# EAGLE design usb_tester_OLED (EAGLE 6.3)
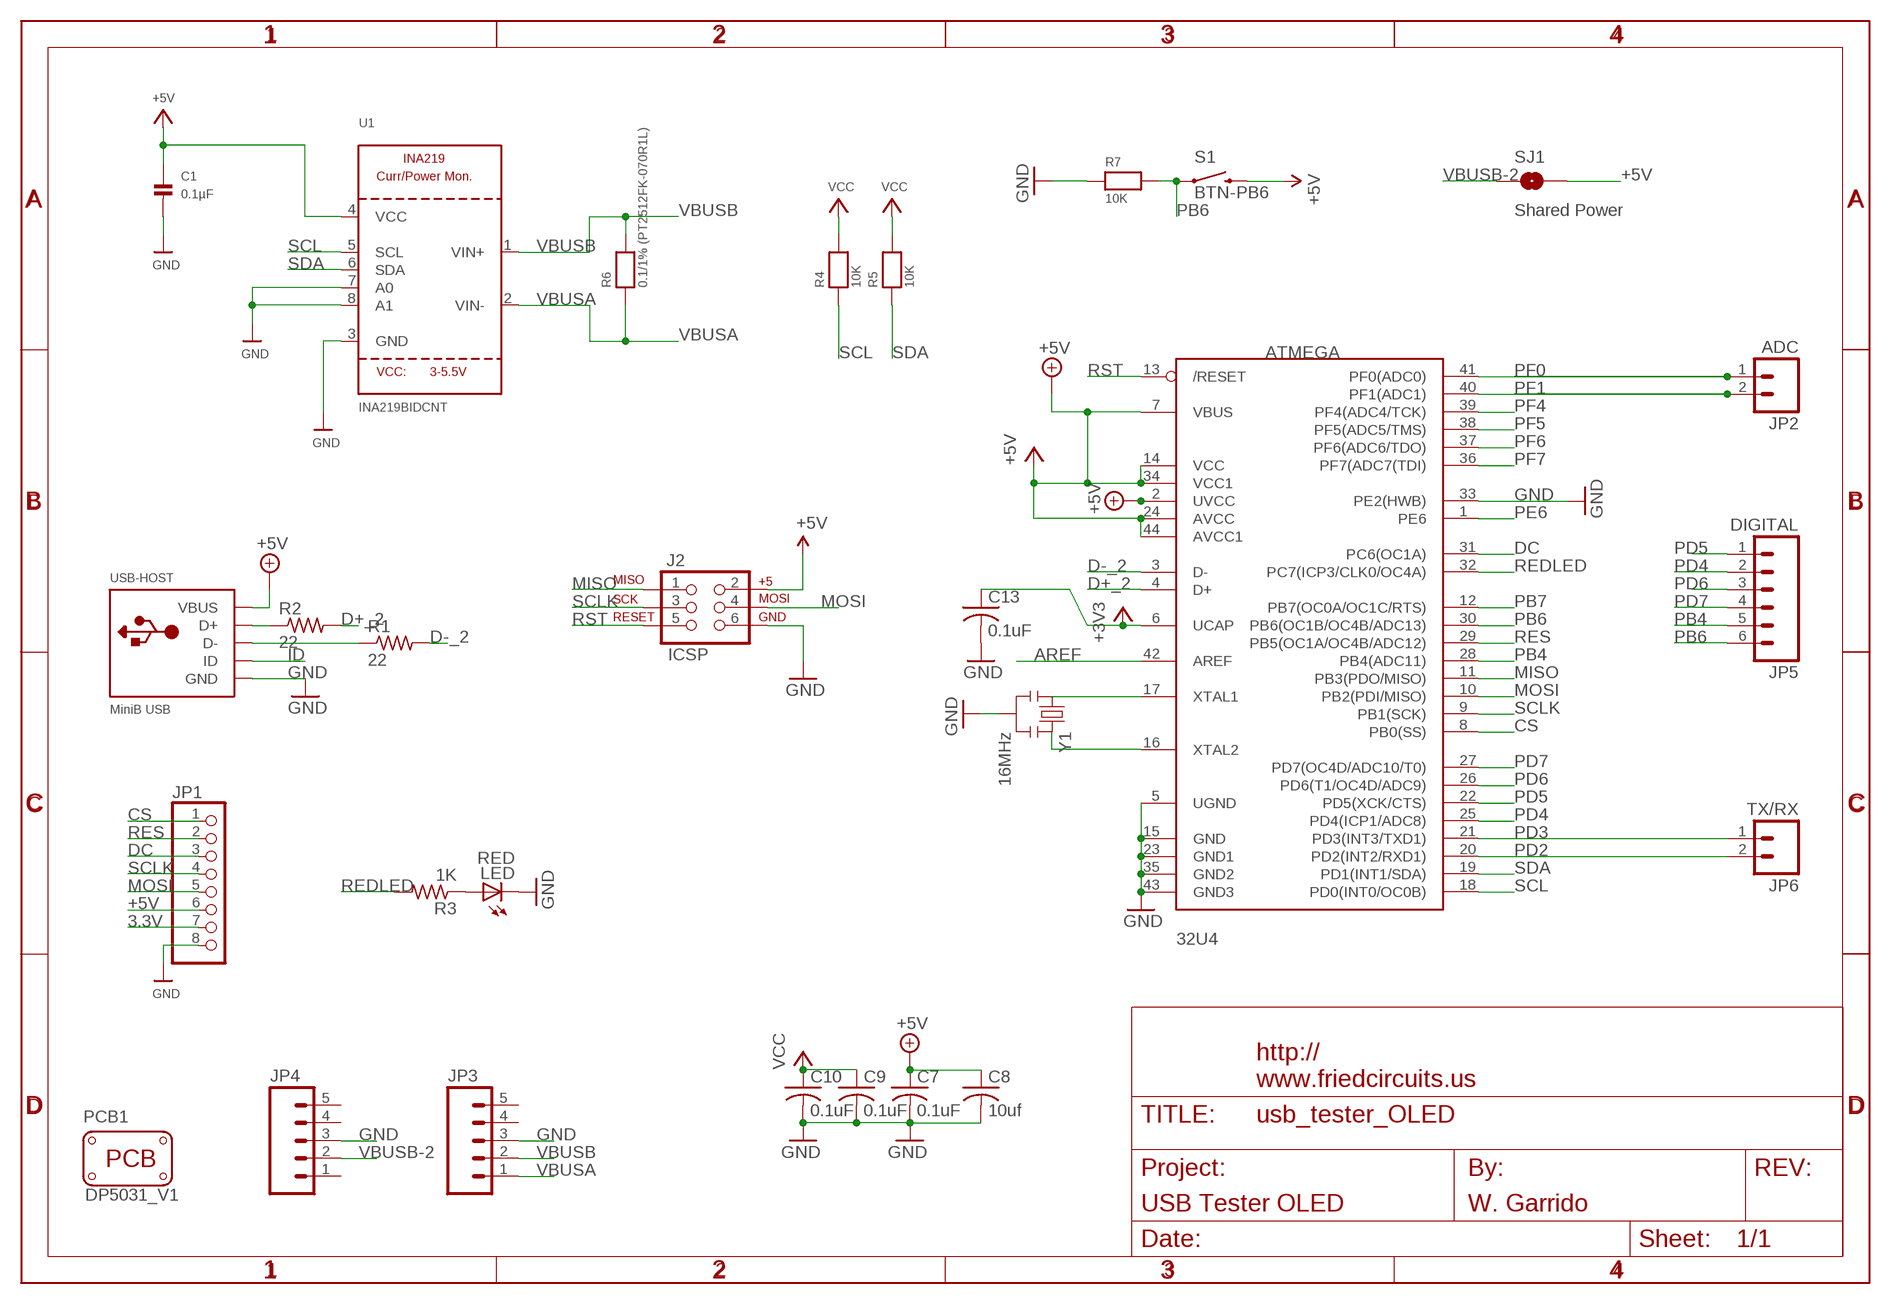
[diagram p0: schematic, sheet 1]

## Parts
32U4  ATMEGA  ATMEGA32U4-AU  [TQFP44]
C1  0.1µF  CAP_CERAMIC0805  [0805]
C7  0.1uF  C-USC0805K  [C0805K]
C8  10uf  C-USC0805K  [C0805K]
C9  0.1uF  C-USC0805K  [C0805K]
C10  0.1uF  C-USC0805K  [C0805K]
C13  0.1uF  C-USC0805K  [C0805K]
J2  ICSP  AVR_SPI_PRG_62X3_LOCK  [2X3_LOCK]
JP1  HEADER-1X876MIL  [1X08_ROUND_76]
JP2  ADC  M02LOCK  [1X02_LOCK]
JP3  M05LOCK  [1X05_LOCK]
JP4  M05LOCK  [1X05_LOCK]
JP5  DIGITAL  M06LOCK  [1X06_LOCK]
JP6  TX/RX  M02LOCK  [1X02_LOCK]
LED  RED  LEDCHIPLED_0805  [CHIPLED_0805]
PCB1  PCB_DP_RECTANGLE-31X50  [DP5031_V1]
R1  22  R-US_R0805  [R0805]
R2  22  R-US_R0805  [R0805]
R3  1K  R-US_R0805  [R0805]
R4  10K  RESISTOR0805  [0805]
R5  10K  RESISTOR0805  [0805]
R6  0.1/1% (PT2512FK-070R1L)  RESISTOR2512  [2512]
R7  10K  RESISTOR0805  [0805]
S1  BTN-PB6  SWITCH-MOMENTARY-2SMD  [TACTILE_SWITCH_SMD]
SJ1  Shared Power  SOLDERJUMPERTRACE  [SJ_2S-TRACE]
U1  INA219BIDCNT  INA219  [SOT23-8]
U$1  FRAME_DINA4_L  [FC_CREDIT]
USB-HOST  MiniB USB  USBMINIB  [USB-MINIB]
Y1  16MHz  RESONATOR16MHZ  [RESONATOR-SMD]

## Nets
3.3V: JP1.7
+3V3 [+3V3]: 32U4.6(UCAP) C13.1
+5V [+5V]: 32U4.2(UVCC) 32U4.7(VBUS) 32U4.14(VCC) 32U4.24(AVCC) 32U4.34(VCC1) 32U4.44(AVCC1) C1.1 C7.1 C8.1 C9.1 C10.1 J2.2 JP1.6 R4.2 R5.2 S1.3 SJ1.2 U1.4(VCC) USB-HOST.VBUS ; supply symbol labelled VCC
AREF: 32U4.42(AREF)
CS: 32U4.8(PB0(SS)) JP1.1
D+_2: 32U4.4(D+) R2.2
D-_2: 32U4.3(D-) R1.2
DC: 32U4.31(PC6(OC1A)) JP1.3
GND: 32U4.5(UGND) 32U4.15(GND) 32U4.23(GND1) 32U4.33(PE2(HWB)) 32U4.35(GND2) 32U4.43(GND3) C1.2 C7.2 C8.2 C9.2 C10.2 C13.2 J2.6 JP1.8 JP3.3 JP4.3 LED.C R7.1 U1.3(GND) U1.7(A0) U1.8(A1) USB-HOST.GND Y1.2
ID: USB-HOST.ID
MISO: 32U4.11(PB3(PDO/MISO)) J2.1
MOSI: 32U4.10(PB2(PDI/MISO)) J2.4 JP1.5
N$1: LED.A R3.1
N$2: R2.1 USB-HOST.D+
N$4: R1.1 USB-HOST.D-
N$8: 32U4.17(XTAL1) Y1.1
N$9: 32U4.16(XTAL2) Y1.3
PB4: 32U4.28(PB4(ADC11)) JP5.5
PB6: 32U4.30(PB6(OC1B/OC4B/ADC13)) JP5.6 R7.2 S1.1
PB7: 32U4.12(PB7(OC0A/OC1C/RTS))
PD2: 32U4.20(PD2(INT2/RXD1)) JP6.2
PD3: 32U4.21(PD3(INT3/TXD1)) JP6.1
PD4: 32U4.25(PD4(ICP1/ADC8)) JP5.2
PD5: 32U4.22(PD5(XCK/CTS)) JP5.1
PD6: 32U4.26(PD6(T1/OC4D/ADC9)) JP5.3
PD7: 32U4.27(PD7(OC4D/ADC10/T0)) JP5.4
PE6: 32U4.1(PE6)
PF0: 32U4.41(PF0(ADC0)) JP2.1
PF1: 32U4.40(PF1(ADC1)) JP2.2
PF4: 32U4.39(PF4(ADC4/TCK))
PF5: 32U4.38(PF5(ADC5/TMS))
PF6: 32U4.37(PF6(ADC6/TDO))
PF7: 32U4.36(PF7(ADC7(TDI))
REDLED: 32U4.32(PC7(ICP3/CLK0/OC4A)) R3.2
RES: 32U4.29(PB5(OC1A/OC4B/ADC12)) JP1.2
RST: 32U4.13(/RESET) J2.5
SCL: 32U4.18(PD0(INT0/OC0B)) R4.1 U1.5(SCL)
SCLK: 32U4.9(PB1(SCK)) J2.3 JP1.4
SDA: 32U4.19(PD1(INT1/SDA)) R5.1 U1.6(SDA)
VBUSA [VBUS]: JP3.1 R6.1 U1.2(VIN-)
VBUSB [VBUS]: JP3.2 R6.2 U1.1(VIN+)
VBUSB-2: JP4.2 SJ1.1
Unconnected: JP3.4 JP3.5 JP4.1 JP4.4 JP4.5

## Library data of the parts
32U4 = adafruit:ATMEGA32U4: http://www.ladyada.net/library/eagle
C1 = microbuilder:CAP_CERAMIC: Ceramic Capacitors 0402 - 0402 Surface Mount Capacitors 16pF 50V 5% [Digikey: 445-4899-2-ND] 18pF 50V 5% [Digikey: 490-1281-2-ND] 22pF 50V 5% [Digikey: 490-1283-2-ND] 68pF 50V 5% [Digikey: 490-1289-2-ND] 0.1uF 10V 10% [Digikey: 490-1318-2-ND] 1.0uF 6.3V 10% [Digikey: 490-1320-2-ND] 0603 - 0603 Surface Mount Capacitors 16 pF 50V 5% [Digikey: 445-5051-2-ND] 22 pF 50V [Digikey: PCC220ACVTR-ND] 33 pF 50V 5% [Digikey: 490-1415-1-ND] 56pF 50V 5% [Digikey: 490-1421-1-ND] 220pF 50V 5% [Digikey: 445-1285-1-ND] 680 pF 50V 2200 pF 50V 5% C0G [Digikey: 445-1297-1-ND] 5600 pF 100V 5% X7R [Digikey: 478-3711-1-ND] 0.1 µF 25V 10% [Digikey: PCC2277TR-ND] 0.22 µF 16V 10% X7R [Digikey: 445-1318-1-ND] 1.0 µF 25V 10% [Digikey: 445-5146-2-ND] 0603 - RF Specific 3pF 250V +/-0.1pF RF [Digikey: 712-1347-1-ND] 18 pF 250V 5% [Digikey: 478-3505-1-ND or 712-1322-1-ND] 56 pF 250V 5% C0G RF [Digikey: 490-4867-1-ND] 68 pF 250V RF [Digikey: 490-4868-1-ND] 0805 - 0805 Surface Mount Capacitors 220 pF 250V 2% RF Ceramic Capacitor [Digikey: 712-1398-1-ND] 1000 pF 50V 2% NP0 Ceramic Capacitor [Digikey: 478-3760-1-ND] 0.1 µF 25V 10% Ceramic Capacitor [Digikey: PCC1828TR-ND] 1.0 µF 16V 10% Ceramic Capacitor[Digikey: 490-1691-2-ND] 10.0 µF 10V 10% Ceramic Capacitor[Digikey: 709-1228-1-ND] 10.0 uF 16V 10% Ceramic Capacitor [Digikey: 478-5165-2-ND] 47 uF 6.3V 20% Ceramic Capacitor [Digikey: 587-1779-1-ND or 399-5506-1-ND] 1206 - 1206 Surface Mount Capacitors 47uF 10V 20% Ceramic Capacitor [Digikey: 490-5528-1-ND or 399-5508-1-ND or 445-6010-1-ND] 100uF 6.3V -20%, +80% Y5V Ceramic Capacitor (Digikey: 490-4512-1-ND, Mouser: 81-GRM31CF50J107ZE1L)
C7-C10 C13 = adafruit:C-US: CAPACITOR, American symbol
J2 = SparkFun-Connectors:AVR_SPI_PRG_6: AVR ISP 6 Pin This is the reduced ISP connector for AVR programming. Common on Arduino. This footprint will take up less PCB space and can be used with a 10-pin to 6-pin adapter such as SKU: BOB-08508
JP1 = microbuilder:HEADER-1X8: PIN HEADER
JP2 JP6 = SparkFun-Connectors:M02: Header 2 Standard 2-pin 0.1" header. Use with straight break away headers (SKU : PRT-00116), right angle break away headers (PRT-00553), swiss pins (PRT-00743), machine pins (PRT-00117), and female headers (PRT-00115). Molex polarized connector foot print use with SKU : PRT-08233 with associated crimp pins and housings.
JP3 JP4 = SparkFun-Connectors:M05: Header 5 Standard 5-pin 0.1" header. Use with straight break away headers (SKU : PRT-00116), right angle break away headers (PRT-00553), swiss pins (PRT-00743), machine pins (PRT-00117), and female headers (PRT-00115). Molex polarized connector foot print use with SKU : PRT-08230 with associated crimp pins and housings.
JP5 = SparkFun-Connectors:M06: Header 6 Standard 6-pin 0.1" header. Use with straight break away headers (SKU : PRT-00116), right angle break away headers (PRT-00553), swiss pins (PRT-00743), machine pins (PRT-00117), and female headers (PRT-00115). Molex polarized connector foot print use with SKU : PRT-08094 with associated crimp pins and housings. NOTES ON THE VARIANTS LOCK and LOCK_LONGPADS... This footprint was designed to help hold the alignment of a through-hole component (i.e. 6-pin header) while soldering it into place. You may notice that each hole has been shifted either up or down by 0.005 of an inch from it's more standard position (which is a perfectly straight line). This slight alteration caused the pins (the squares in the middle) to touch the edges of the holes. Because they are alternating, it causes a "brace" to hold the component in place. 0.005 has proven to be the perfect amount of "off-center" position when using our standard breakaway headers. Although looks a little odd when you look at the bare footprint, once you have a header in there, the alteration is very hard to notice. Also, if you push a header all the way into place, it is covered up entirely on the bottom side. This idea of altering the position of holes to aid alignment will be further integrated into the Sparkfun Library for other footprints. It can help hold any component with 3 or more connection pins.
LED = adafruit:LED: LED OSRAM: - CHIPLED LG R971, LG N971, LY N971, LG Q971, LY Q971, LO R971, LY R971 LH N974, LH R974 LS Q976, LO Q976, LY Q976 LO Q996 - Hyper CHIPLED LW Q18S LB Q993, LB Q99A, LB R99A - SideLED LS A670, LO A670, LY A670, LG A670, LP A670 LB A673, LV A673, LT A673, LW A673 LH A674 LY A675 LS A676, LA A676, LO A676, LY A676, LW A676 LS A679, LY A679, LG A679 - Hyper Micro SIDELED® LS Y876, LA Y876, LO Y876, LY Y876 LT Y87S - SmartLED LW L88C, LW L88S LB L89C, LB L89S, LG L890 LS L89K, LO L89K, LY L89K LS L896, LA L896, LO L896, LY L896 - TOPLED LS T670, LO T670, LY T670, LG T670, LP T670 LSG T670, LSP T670, LSY T670, LOP T670, LYG T670 LG T671, LOG T671, LSG T671 LB T673, LV T673, LT T673, LW T673 LH T674 LS T676, LA T676, LO T676, LY T676, LB T676, LH T676, LSB T676, LW T676 LB T67C, LV T67C, LT T67C, LS T67K, LO T67K, LY T67K, LW E67C LS E67B, LA E67B, LO E67B, LY E67B, LB E67C, LV E67C, LT E67C LW T67C LS T679, LY T679, LG T679 LS T770, LO T770, LY T770, LG T770, LP T770 LB T773, LV T773, LT T773, LW T773 LH T774 LS E675, LA E675, LY E675, LS T675 LS T776, LA T776, LO T776, LY T776, LB T776 LHGB T686 LT T68C, LB T68C - Hyper Mini TOPLED® LB M676 - Mini TOPLED Santana® LG M470 LS M47K, LO M47K, LY M47K Source: http://www.osram.convergy.de/
PCB1 = dp_devices:PCB_DP_RECTANGLE: Dangerous Prototypes Standard Rectangular PCB sizes; PCB_SIZE: DP5031_V1
R1-R3 = adafruit:R-US_: RESISTOR, American symbol
R4-R7 = microbuilder:RESISTOR: Resistors 0402 - 0402 Surface Mount Package 22 Ohm 1% 1/16W [Digikey: 311-22.0LRTR-ND] 33 Ohm 5% 1/16W 1.0K 5% 1/16W 1.5K 5% 1/16W 2.0K 1% 1/16W 10.0K 1% 1/16W [Digikey: 311-10.0KLRTR-ND] 10.0K 5% 1/16W [Digikey: RMCF0402JT10K0TR-ND] 12.1K 1% 1/16W [Digikey: 311-22.0LRTR-ND] 100.0K 5% 1/16W 0603 - 0603 Surface Mount Package 0 Ohm 1/10 Watt 1% Resistor 15 Ohm 1/10 Watt 1% Resistor 33 Ohm 1/10 Watt 1% Resistor 49.9 Ohm 1/10 Watt 1% Resistor 100 Ohm 1/10 Watt 1% Resistor 150 Ohm 1/10 Watt 1% Resistor 240 Ohm 1/10 Watt 1% Resistor 390 Ohm 1/10 Watt 1% Resistor 560 Ohm 1/10 Watt 1% Resistor 680 Ohm 1/10 Watt 1% Resistor 750 Ohm 1/10 Watt 1% Resistor 1.0K Ohm 1/10 Watt 1% Resistor 1.5K Ohm 1/10 Watt 1% Resistor 2.0K Ohm 1/10 Watt 1% Resistor 2.2K Ohm 1/10 Watt 1% Resistor 3.3K Ohm 1/10 Watt 1% Resistor 4.7K Ohm 1/10 Watt 1% Resistor 10.0K Ohm 1/10 Watt 1% Resistor 12.0K Ohm 1/10 Watt 1% Resistor 12.1K Ohm 1/10 Watt 1% Resistor 20.0K Ohm 1/10 Watt 1% Resistor 33.0K Ohm 1/10 Watt 1% Resistor 100.0K Ohm 1/10 Watt 1% Resistor 0805 - 0805 Surface Mount Package 0 Ohm 1/8 Watt 1% Resistor 33 Ohm 1/8 Watt 1% Resistor 100 Ohm 1/8 Watt 1% Resistor 150 Ohm 1/8 Watt 1% Resistor 200 Ohm 1/8 Watt 1% Resistor 240 Ohm 1/8 Watt 1% Resistor 330 Ohm 1/8 Watt 1% Resistor 390 Ohm 1/8 Watt 1% Resistor 470 Ohm 1/8 Watt 1% Resistor 1.0K Ohm 1/8 Watt 1% Resistor 1.5K Ohm 1/8 Watt 1% Resistor 2.0K Ohm 1/8 Watt 1% Resistor 4.7K Ohm 1/8 Watt 1% Resistor 5.1K Ohm 1/8 Watt 1% Resistor 5.6K Ohm 1/8 Watt 1% Resistor 10.0K Ohm 1/8 Watt 1% Resistor 22.0K Ohm 1/8 Watt 1% Resistor 33.0K Ohm 1/8 Watt 1% Resistor 100K Ohm 1/8 Watt 1% Resistor 1206 - 1206 Surface Mount Package 2012 - 2010 Surface Mount Package 0.11 Ohm 1/2 Watt 1% Resistor - Digikey: RHM.11UCT-ND
S1 = SparkFun-Electromechanical:SWITCH-MOMENTARY-2: Various NO switches- pushbuttons, reed, etc
SJ1 = SparkFun-Passives:SOLDERJUMPER: Solder Jumper Standard SMD solder jumper. Used to automate production. Two varients : Normally Open and Normally Closed are the same, but have different paste layers. NC will have a large amount of paste and should jumper during reflow.
U1 = microbuilder:INA219: INA219 - I2C Current/Power Monitor Voltage Range: 0-26V Accuracy: 0.5% Temperature: -40°C - 125°C
U$1 = FriedCircuits:FRAME_DINA4_L: A4 FC frame Standard FriedCircuits schematic frame. Automagically adds the standard texts to the PCB Use the atrribute in the schematic editor to change the fields.; AUTHOR: W. Garrido; FF2: FriedCircuits; FF3: www.friedcircuits.us; PROJECT: USB Tester OLED; URL1: http://; URL2: www.friedcircuits.us
USB-HOST = adafruit:USB: USB Connectors USBMINIB - Surface Mount Female Mini-B USB Connector 4UConnector: 06564 By microbuilder.eu Thru-hole RA Female Mini-B USB Connector 4UConnector: 18732 By ladyada.net
Y1 = SparkFun-FreqCtrl:RESONATOR: Resonator Small SMD resonator. Used, eg, on the Arduino Pro/ Pro Mini boards. 8MHz- XTAL-08895 16MHz- XTAL-08900; PROD_ID: XTAL-08900

## Net classes
0 default: width 0.254 mm, drill 0.254 mm
1 VCC: width 0.203 mm, drill 0.203 mm
2 VBUS: width 0.406 mm, drill 0.254 mm
3 +5V: width 0.203 mm, drill 0.203 mm
4 +3V3: width 0.203 mm, drill 0.203 mm

## Board
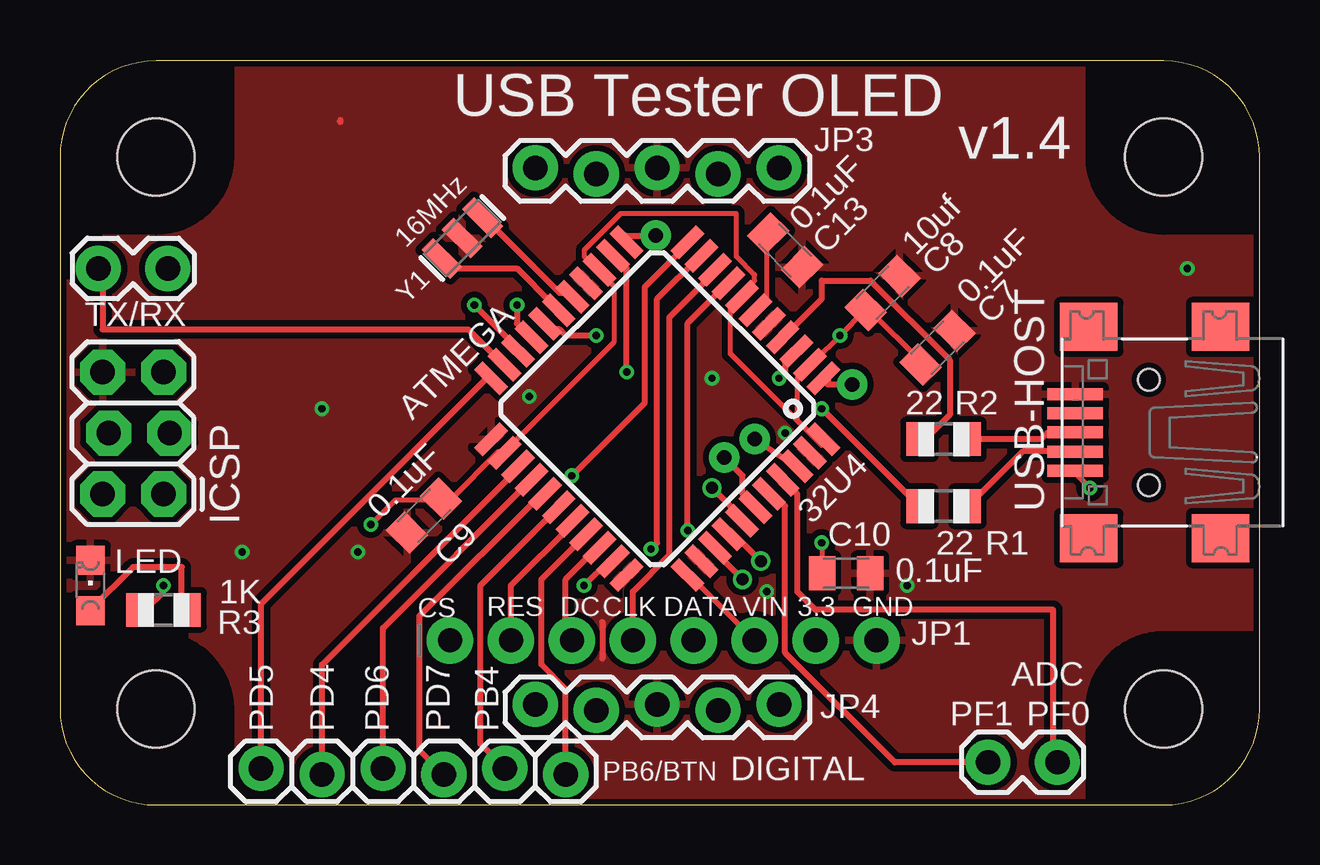
[diagram p1: board, top side]
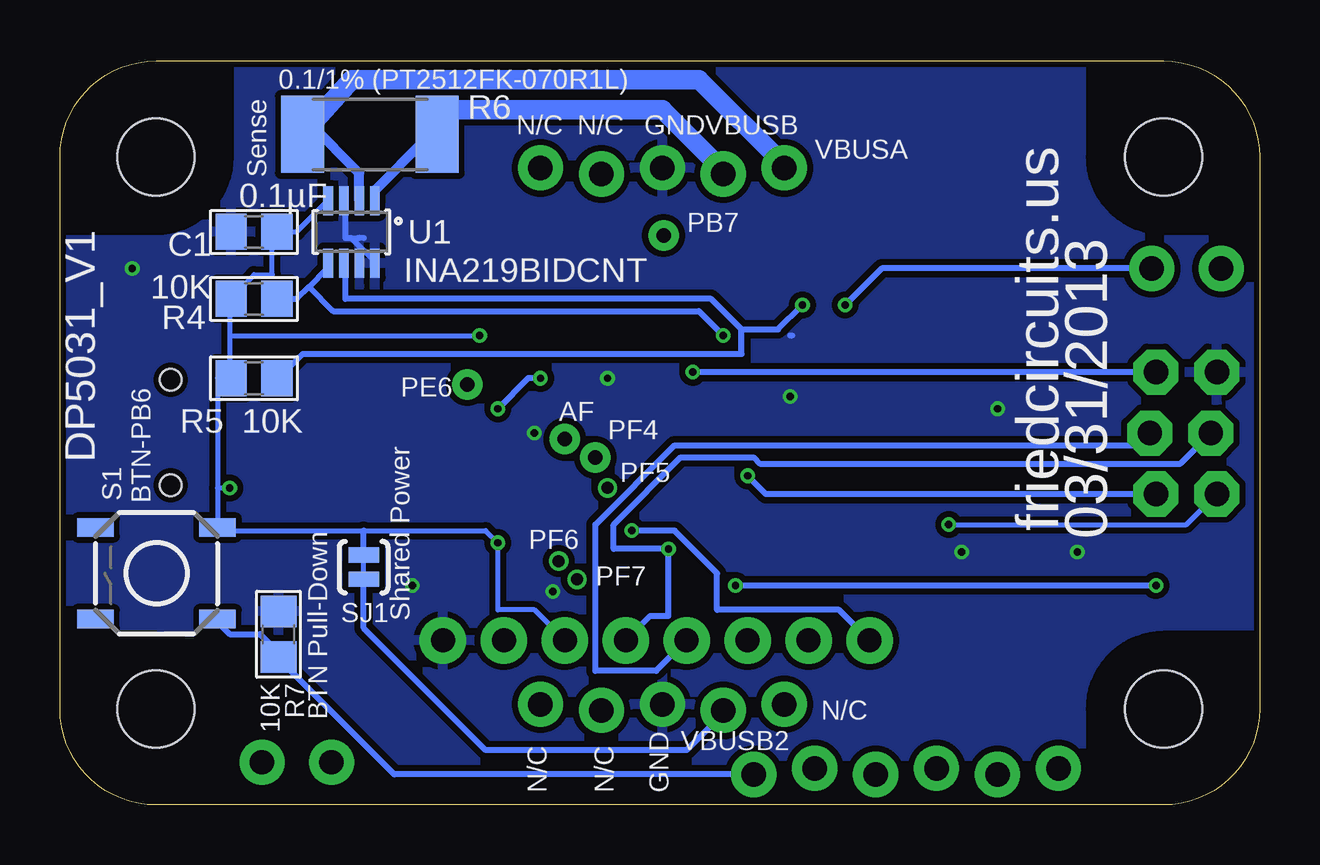
[diagram p2: board, bottom side, seen from below]

Size 50 x 31 mm. Coordinates in mm from the lower left corner, seen from the top.
Copper layers (1*16): Top 0.035mm / dielectric 1.5mm / Bottom 0.035mm
Design rules "Fusion_eagle_rule_v1.1": minimum track width 6mil, minimum drill 12mil, track to track 6mil, track to pad 6mil, pad to pad 6mil, via to via 6mil, smd to smd 0mil, copper to edge 10mil, drill to drill 10mil, minimum pad ring 10mil, minimum via ring 6mil, stop-mask expansion 2mil, vias tented up to drill 100mil, thermal gap 10mil

### Footprints (pad centres in the part's own frame; a part is rotated, then mirrored left to right if it is on the bottom)
TQFP44 = smd 1.5 x 0.5: 1 -5.8,4; 2 -5.8,3.2; 3 -5.8,2.4; 4 -5.8,1.6; 5 -5.8,0.8; 6 -5.8,0; 7 -5.8,-0.8; 8 -5.8,-1.6; 9 -5.8,-2.4; 10 -5.8,-3.2; 11 -5.8,-4; 23 5.8,-4; 24 5.8,-3.2; 25 5.8,-2.4; 26 5.8,-1.6; 27 5.8,-0.8; 28 5.8,0; 29 5.8,0.8; 30 5.8,1.6; 31 5.8,2.4; 32 5.8,3.2; 33 5.8,4 | smd 0.5 x 1.5: 12 -4,-5.8; 13 -3.2,-5.8; 14 -2.4,-5.8; 15 -1.6,-5.8; 16 -0.8,-5.8; 17 0,-5.8; 18 0.8,-5.8; 19 1.6,-5.8; 20 2.4,-5.8; 21 3.2,-5.8; 22 4,-5.8; 34 4,5.8; 35 3.2,5.8; 36 2.4,5.8; 37 1.6,5.8; 38 0.8,5.8; 39 0,5.8; 40 -0.8,5.8; 41 -1.6,5.8; 42 -2.4,5.8; 43 -3.2,5.8; 44 -4,5.8
0805 = smd 1.3 x 1.5: 1 -0.95,0; 2 0.95,0
C0805K = smd 1.1 x 1.4: 1 -1,0; 2 1,0
2X3_LOCK = drill 1.016 pad 1.88 octagon: 1 0,0; 2 0,2.54; 3 2.54,-0.254; 4 2.54,2.286; 5 5.08,0; 6 5.08,2.54
1X08_ROUND_76 = drill 1 pad 1.93: 1 -8.89,0; 2 -6.35,0; 3 -3.81,0; 4 -1.27,0; 5 1.27,0; 6 3.81,0; 7 6.35,0; 8 8.89,0
1X02_LOCK = drill 1.016 pad 1.88: 1 -0.178,0; 2 2.718,0
1X05_LOCK = drill 1.016 pad 1.88: 1 0,0.127; 2 2.54,-0.127; 3 5.08,0.127; 4 7.62,-0.127; 5 10.16,0.127
1X06_LOCK = drill 1.016 pad 1.88: 1 0,0; 2 2.54,-0.254; 3 5.08,0; 4 7.62,-0.254; 5 10.16,0; 6 12.7,-0.254
CHIPLED_0805 = smd 1.2 x 1.2: A 0,-1.05; C 0,1.05
DP5031_V1 = hole 3.2: 4,4; 46,4; 46,27; 4,27
R0805 = smd 1.1 x 1.4: 1 -1,0; 2 1,0
2512 = smd 1.8 x 3.2: 1 -2.8,0; 2 2.8,0
TACTILE_SWITCH_SMD = smd 1.524 x 0.762: 1 -2.54,1.905; 2 2.54,1.905; 3 -2.54,-1.905; 4 2.54,-1.905
SJ_2S-TRACE = smd 0.635 x 1.27: 1 -0.508,0; 2 0.508,0
SOT23-8 = smd 0.4 x 1.2: 1 -0.975,-1.3; 2 -0.325,-1.3; 3 0.325,-1.3; 4 0.975,-1.3; 5 0.975,1.3; 6 0.325,1.3; 7 -0.325,1.3; 8 -0.975,1.3
USB-MINIB = smd 0.5 x 2.308: D+ 0,4.064; D- -0.8,4.064; GND 1.6,4.064; ID 0.8,4.064; VBUS -1.6,4.064 | smd 2 x 2.4: GND1 -4.4,-2; GND2 -4.4,3.5; GND3 4.4,3.5; GND4 4.4,-2 | hole 0.9: -2.2,1; 2.2,1
RESONATOR-SMD = smd 0.7 x 1.7: 1 -1.2,0; 2 0,0; 3 1.2,0

### Placement (x,y rotation side)
32U4  24.89,16.51 225 top
C1  41.91,23.88 180 bottom
C7  36.58,19.05 45 top
C8  34.29,21.34 45 top
C9  15.17,12.05 225 top
C10  32.77,9.65 0 top
C13  30.23,23.11 315 top
J2  4.32,12.95 90 top
JP1  25.15,6.86 0 top
JP2  41.4,1.78 180 top
JP3  19.81,26.42 0 top
JP4  19.81,4.06 0 top
JP5  8.38,1.52 0 top
JP6  1.78,22.35 0 top
LED  1.27,9.14 0 top
PCB1  0,0 0 top
R1  36.83,12.45 180 top
R2  36.83,15.24 180 top
R3  4.32,8.13 180 top
R4  41.91,21.08 180 bottom
R5  41.91,17.78 180 bottom
R6  37.08,27.94 0 bottom
R7  40.89,7.11 270 bottom
S1  45.97,9.65 180 bottom
SJ1  37.34,9.91 90 bottom
U1  37.85,23.88 180 bottom
U$1  -19.05,-2.54 0 top  (outside the outline)
USB-HOST  46.38,15.52 90 top
Y1  16.76,23.62 45 top

### Tracks (layer width: path | path; a pad name or v marks a point on that pad's centre or on a via)
+3V3
  Top 0.203: 32U4.6 29.46,21.08 29.46,23.62 C13.1
+5V  (via drill 0.3)
  Top 0.203: JP1.6 26.42,9.4 32U4.34 | C7.1 35.81,18.54 33.78,20.57 C8.1 v32.51,19.56 31.5,18.54 32U4.2 31.24,18.29 30.73,17.78 30.73,16 | 30.73,16 31.75,14.99 32U4.44 | 30.73,16 27.94,18.8 27.94,20.83 28.19,21.08 32U4.7 28.45,21.34 28.96,21.84 28.96,22.1 28.19,22.86 28.19,24.64 23.37,24.64 21.84,23.11 21.84,22.86 22.35,22.35 32U4.14 22.61,22.1 23.11,21.59 23.11,19.3 18.54,14.73 32U4.24 18.29,14.73 16.26,12.7 C9.1 15.75,12.7 13.97,12.7 v12.95,11.68 | v31.75,10.92 31.75,9.65 C10.1 | v42.93,13.21 42.42,13.72 USB-HOST.VBUS
  Bottom 0.203: U1.4 38.86,25.15 40.13,23.88 C1.1 41.15,23.88 41.15,22.1 41.91,22.1 42.93,21.08 | J2.2 3.05,11.68 v12.95,11.68 | JP1.6 30.23,8.13 31.75,8.13 v31.75,10.92 32.26,11.43 37.34,11.43 43.43,11.43 S1.3 43.43,13.21 | 42.93,21.08 42.93,19.56 | 42.93,19.56 42.93,17.78 | 43.43,13.21 43.43,17.78 42.93,17.78 | 42.93,17.78 R5.2 | 43.43,13.21 v42.93,13.21 | 42.93,21.08 R4.2 | 42.93,19.56 v32.51,19.56
  Bottom 0.254: SJ1.2 37.34,11.43
AREF  (via drill 0.6 pad 1.27)
  Top 0.254: v28.96,15.24 30.48,14.22 32U4.42
CS  (via drill 0.3)
  Top 0.254: v26.16,11.43 26.16,20.07 27.69,21.59 32U4.8
  Bottom 0.254: v26.16,11.43 24.38,11.43 22.61,9.65 22.61,8.13 17.53,8.13 JP1.1
D+_2
  Top 0.254: R2.2 36.07,15.24 37.08,16.26 37.08,18.54 33.78,21.84 31.75,21.84 31.75,21.08 30.23,19.56 32U4.4
D-_2  (via drill 0.3)
  Top 0.254: v31.75,16.51 35.81,12.45 R1.2 | v29.97,17.78 30.23,18.03 30.23,18.54 30.48,18.8 32U4.3
  Bottom 0.254: v31.75,16.51 30.48,17.78 v29.97,17.78
DC
  Top 0.254: JP1.3 21.08,7.11 21.08,9.4 22.35,10.67 32U4.31
GND  (via drill 0.3)
  Top 0.254: 42.32,16.98 42.42,17.02 USB-HOST.GND | 24.89,4.32 JP4.3 | 11.68,28.45 11.68,28.54 | 22.61,7.62 22.61,6.1
  Bottom 0.254: 37.85,23.62 38.1,23.62 38.1,25.15 U1.3 | 37.85,23.62 36.83,22.61 U1.8 | 37.34,23.62 37.53,23.63 37.59,23.62 37.85,23.62 | 19.56,19.56 19.48,19.57
  other vias: 27.18,17.78 29.46,8.89 10.92,16.51 46.99,22.35 12.42,10.54 35.31,9.14 30.23,15.49 19.56,17.02 7.59,10.54
  pour Top (isolate 0.254): 0,31.24 0,0 50.55,0.25 50.55,31.5
  pour Bottom (isolate 0.254): 0,0 50.8,0 50.8,31.75 0,31.75
MISO  (via drill 0.3)
  Top 0.254: v21.34,13.72 24.38,16.76 24.38,21.59 26.16,23.37 32U4.11
  Bottom 0.254: v21.34,13.72 20.57,12.95 J2.1
MOSI  (via drill 0.3)
  Top 0.254: v24.64,10.67 24.89,10.92 24.89,21.08 26.67,22.86 32U4.10
  Bottom 0.254: JP1.5 25.4,7.87 24.64,7.87 v24.64,10.67 26.92,10.67 26.92,11.68 24.13,14.48 21.08,14.48 20.83,14.22 3.3,14.22 J2.4
N$1
  Top 0.254: LED.A 1.27,8.13 3.05,9.91 5.08,9.91 5.08,8.13 R3.1
N$2
  Top 0.254: R2.1 40.89,15.24 41.15,15.49 42.16,15.49 USB-HOST.D+
N$4
  Top 0.254: R1.1 37.85,12.45 40.13,14.73 42.16,14.73 USB-HOST.D-
N$8
  Top 0.254: 32U4.17 20.57,20.83 19.05,22.35 16,22.35 16,22.61 Y1.1
N$9
  Top 0.254: 32U4.16 21.34,21.34 20.83,21.34 17.78,24.38 Y1.3
PB4
  Top 0.254: 32U4.28 17.53,9.14 17.53,2.54 JP5.5
PB6
  Top 0.254: JP5.6 21.08,4.83 20.07,5.84 20.07,9.4 21.84,11.18 32U4.30
  Bottom 0.254: 43.94,7.62 S1.1 43.43,7.62 42.93,7.11 41.66,7.11 40.89,6.35 R7.2 40.89,6.1 36.07,1.27 JP5.6
PB7  (via drill 0.6 pad 1.27)
  Top 0.254: v24.84,23.72 23.57,23.72 32U4.12
PD2  (via drill 0.3)
  Top 0.254: v17.27,20.83 19.05,19.05 32U4.20
  Bottom 0.254: v17.27,20.83 15.75,22.35 JP6.2
PD3
  Top 0.254: 32U4.21 18.29,18.54 17.02,19.81 1.78,19.81 1.78,22.35 JP6.1
PD4
  Top 0.254: JP5.2 10.92,5.84 19.05,13.97 32U4.25
PD5
  Top 0.254: JP5.1 8.38,8.38 17.78,17.78 32U4.22
PD6
  Top 0.254: JP5.3 13.46,7.37 19.56,13.46 32U4.26
  Bottom 0.254: 13.21,1.27 JP5.3
PD7
  Top 0.254: JP5.4 14.99,2.29 14.99,7.87 20.07,12.95 32U4.27
PE6  (via drill 0.6 pad 1.27)
  Top 0.254: v33.02,17.53 32,17.53 32,17.78 32U4.1
PF0
  Top 0.254: 32U4.41 30.23,13.46 30.73,12.95 30.73,8.89 31.5,8.13 41.4,8.13 41.4,1.78 JP2.1
PF1
  Top 0.254: JP2.2 34.8,1.78 30.23,6.35 30.23,12.45 29.72,12.95 32U4.40
PF4  (via drill 0.6 pad 1.27)
  Top 0.254: v27.69,14.48 28.45,13.72 28.45,12.95 28.96,12.45 32U4.39
PF5  (via drill 0.5)
  Top 0.254: v27.18,13.21 28.19,12.19 28.19,11.94 32U4.38
PF6  (via drill 0.5)
  Top 0.254: v29.21,10.16 27.94,11.43 32U4.37
PF7  (via drill 0.5)
  Top 0.254: v28.45,9.4 27.43,10.41 27.43,10.67 32U4.36
REDLED  (via drill 0.3)
  Top 0.254: v4.32,9.14 4.32,8.89 3.56,8.13 R3.2 | v21.84,9.14 22.86,10.16 32U4.32
  Bottom 0.254: v21.84,9.14 v4.32,9.14
RES
  Top 0.254: JP1.2 18.8,9.14 21.34,11.68 32U4.29
RST  (via drill 0.3)
  Top 0.254: v23.62,18.03 23.62,22.35 23.11,22.86 32U4.13
  Bottom 0.254: J2.5 v23.62,18.03
SCL  (via drill 0.3)
  Top 0.254: v22.35,19.56 21.08,19.56 20.83,19.81 20.32,19.81 32U4.18
  Bottom 0.254: 39.62,21.59 40.13,21.08 R4.1 | 39.62,21.59 38.86,22.35 U1.5 | v22.35,19.56 23.37,20.57 38.61,20.57 39.62,21.59
SCLK
  Top 0.254: JP1.4 23.88,8.89 25.4,10.41 25.4,20.32 27.18,22.1 32U4.9
  Bottom 0.254: J2.3 5.08,14.99 24.38,14.99 27.69,11.68 27.69,5.59 25.15,5.59 JP1.4
SDA  (via drill 0.3)
  Top 0.254: v19.05,20.83 19.05,20.07 19.56,19.56 32U4.19
  Bottom 0.254: 21.59,19.81 22.86,21.08 38.1,21.08 38.1,22.35 U1.6 | 21.59,19.81 21.59,18.8 39.88,18.8 40.89,17.78 R5.1 | v19.05,20.83 20.07,19.81 21.59,19.81
VBUSA
  Bottom 0.406: U1.2 37.52,26.33 39.53,28.34
  Bottom 0.61: 19.81,26.67 JP3.1 | 39.53,28.34 R6.1
  Bottom 0.813: 19.81,26.67 23.37,30.23 37.85,30.23 39.53,28.34
VBUSB
  Bottom 0.406: U1.1 36.87,25.61 34.8,27.69 34.54,27.69 R6.2
  Bottom 0.61: 22.35,26.42 JP3.2 | 34.29,28.96 R6.2
  Bottom 0.813: 22.35,26.42 24.89,28.96 34.29,28.96
VBUSB-2
  Bottom 0.254: JP4.2 22.35,3.81 23.88,2.29 32.26,2.29 37.34,7.37 SJ1.1

### Text on the board
tPlace: USB Tester OLED | v1.4 | CS | RES | DC | CLK | DATA | VIN | 3.3 | GND | PF0 | PD5 | PD4 | PD6 | PD7 | PB4 | PF1 | PB6/BTN
bPlace: VBUSB | GND | N/C | N/C | friedcircuits.us | VBUSA | Sense | 03/31/2013 | PB7 | PE6 | AF | PF4 | PF5 | PF6 | PF7 | N/C | VBUSB2 | GND | N/C | N/C
bNames: BTN Pull-Down